# Altium schematic sheet DisplayConn.SchDoc
size A4; SheetNumber: 3; SheetTotal: 4
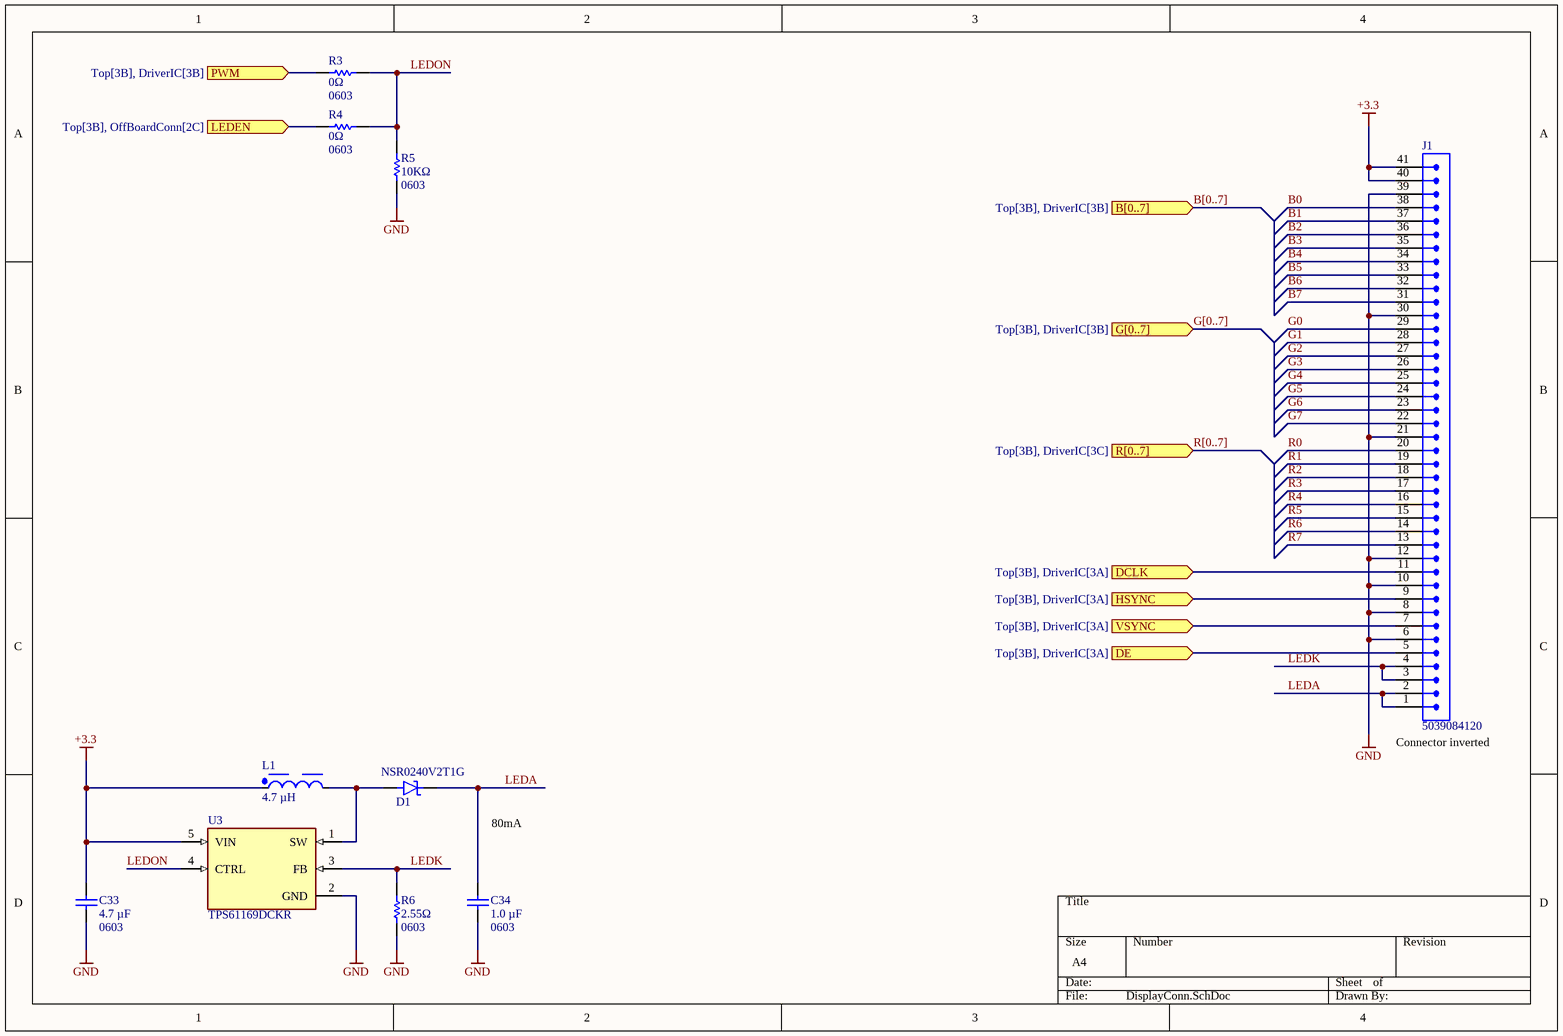
[diagram p0: DisplayConn.SchDoc]

## Parts
C33  value 4.7 µF  [0603]  (hidden comment: GRM188R6YA475KE15D)
C34  value 1.0 µF  [0603]  (hidden comment: GRM188D71H105KE01J)
D1  NSR0240V2T1G  [SOD523]
J1  5039084120  [41POS]
L1  value 4.7 µH  [4.50mm x 4.00mm]  (hidden comment: 744773047)
R3  value 0Ω  [0603]  (hidden comment: RMCF0603ZT0R00)
R4  value 0Ω  [0603]  (hidden comment: RMCF0603ZT0R00)
R5  value 10KΩ  [0603]  (hidden comment: RMCF0603FG10K0)
R6  value 2.55Ω  [0603]  (hidden comment: RMCF0603FT2R55)
U3  TPS61169DCKR  [SOT-353]

## Ports
B[0..7] (in, see Top[3B], DriverIC[3B]), DCLK (in, see Top[3B], DriverIC[3A]), DE (in, see Top[3B], DriverIC[3A]), G[0..7] (in, see Top[3B], DriverIC[3B]), HSYNC (in, see Top[3B], DriverIC[3A]), LEDEN (in, see Top[3B], OffBoardConn[2C]), PWM (in, see Top[3B], DriverIC[3B]), R[0..7] (in, see Top[3B], DriverIC[3C]), VSYNC (in, see Top[3B], DriverIC[3A])

## Nets
+3.3: C33.2 J1.40 J1.41 L1.1 U3.5(VIN)
GND: C33.1 C34.1 J1.6 J1.8 J1.10 J1.12 J1.21 J1.30 J1.39 R5.2 R6.2 U3.2(GND)
B0: J1.38
B1: J1.37
B2: J1.36
B3: J1.35
B4: J1.34
B5: J1.33
B6: J1.32
B7: J1.31
DCLK: J1.11 ; port DCLK
DE: J1.5 ; port DE
G0: J1.29
G1: J1.28
G2: J1.27
G3: J1.26
G4: J1.25
G5: J1.24
G6: J1.23
G7: J1.22
HSYNC: J1.9 ; port HSYNC
LEDA: C34.2 D1.1(C) J1.1 J1.2
LEDEN: R4.2 ; port LEDEN
LEDK: J1.3 J1.4 R6.1 U3.3(FB)
LEDON: R3.1 R4.1 R5.1 U3.4(CTRL)
PWM: R3.2 ; port PWM
R0: J1.20
R1: J1.19
R2: J1.18
R3: J1.17
R4: J1.16
R5: J1.15
R6: J1.14
R7: J1.13
VSYNC: J1.7 ; port VSYNC
NetD1_2: D1.2(A) L1.2 U3.1(SW)

## Buses and harness runs
bus B[0..7] = port B[0..7]
bus G[0..7] = port G[0..7]
bus R[0..7] = port R[0..7]

## Notes on the sheet
- (near J1) Connector inverted
- 80mA

## Library data of the parts
C33 = GRM188R6YA475KE15D: 4.7 µF ±10% 35V Ceramic Capacitor X5R 0603 (1608 Metric); Case: 0603; Tolerance: ±10%; Temperature Coefficient: X5R; Voltage: 35V
C34 = GRM188D71H105KE01J: 1 µF ±10% 50V Ceramic Capacitor X7T 0603 (1608 Metric); Case: 0603; Tolerance: ±10%; Temperature Coefficient: X7T; Voltage: 50V
D1 = NSR0240V2T1G: Diode 40 V 250mA Surface Mount SOD-523; DC Reverse: 40V; Current: 250mA
J1 = 5039084120: 41 Position FFC Connector Contacts, Bottom 0.020" (0.50mm) Surface Mount, Right Angle
L1 = 744773047: 4.7 µH Unshielded Drum Core, Wirewound Inductor 1.82 A 110mOhm Max Nonstandard; Current: 1.82A; Frequency: 50MHz; DC Resistance: 110mOhm
R3 R4 = RMCF0603ZT0R00: 0 Ohms Jumper Chip Resistor 0603 (1608 Metric) Automotive AEC-Q200 Thick Film; Tolerance: 0; Case: 0603; Power: 0
R5 = RMCF0603FG10K0: 10 kOhms ±1% 0.1W, 1/10W Chip Resistor 0603 (1608 Metric) Automotive AEC-Q200 Thick Film; Case: 0603; Tolerance: 1%; Power: 0.1W
R6 = RMCF0603FT2R55: 2.55 Ohms ±1% 0.1W, 1/10W Chip Resistor 0603 (1608 Metric) Automotive AEC-Q200 Thick Film; Case: 0603; Tolerance: 1%; Power: 0.1W
U3 = TPS61169DCKR: LED Driver IC 1 Output DC DC Regulator Step-Up (Boost) PWM Dimming 1.8A (Switch) SC-70-5